# EasyEDA Pro project Usb_Hub-EasyEdaPro_Project.epro

# Schematic Schematic1
Board Name: Board1; Create Date: 2026-04-02; Page Name: P1; Project Name: Usb_Hub; Schematic Name: Schematic1; Update Date: 2026-04-02; Company: EasyEDA.com; Page Size: A4; Version: V1.0
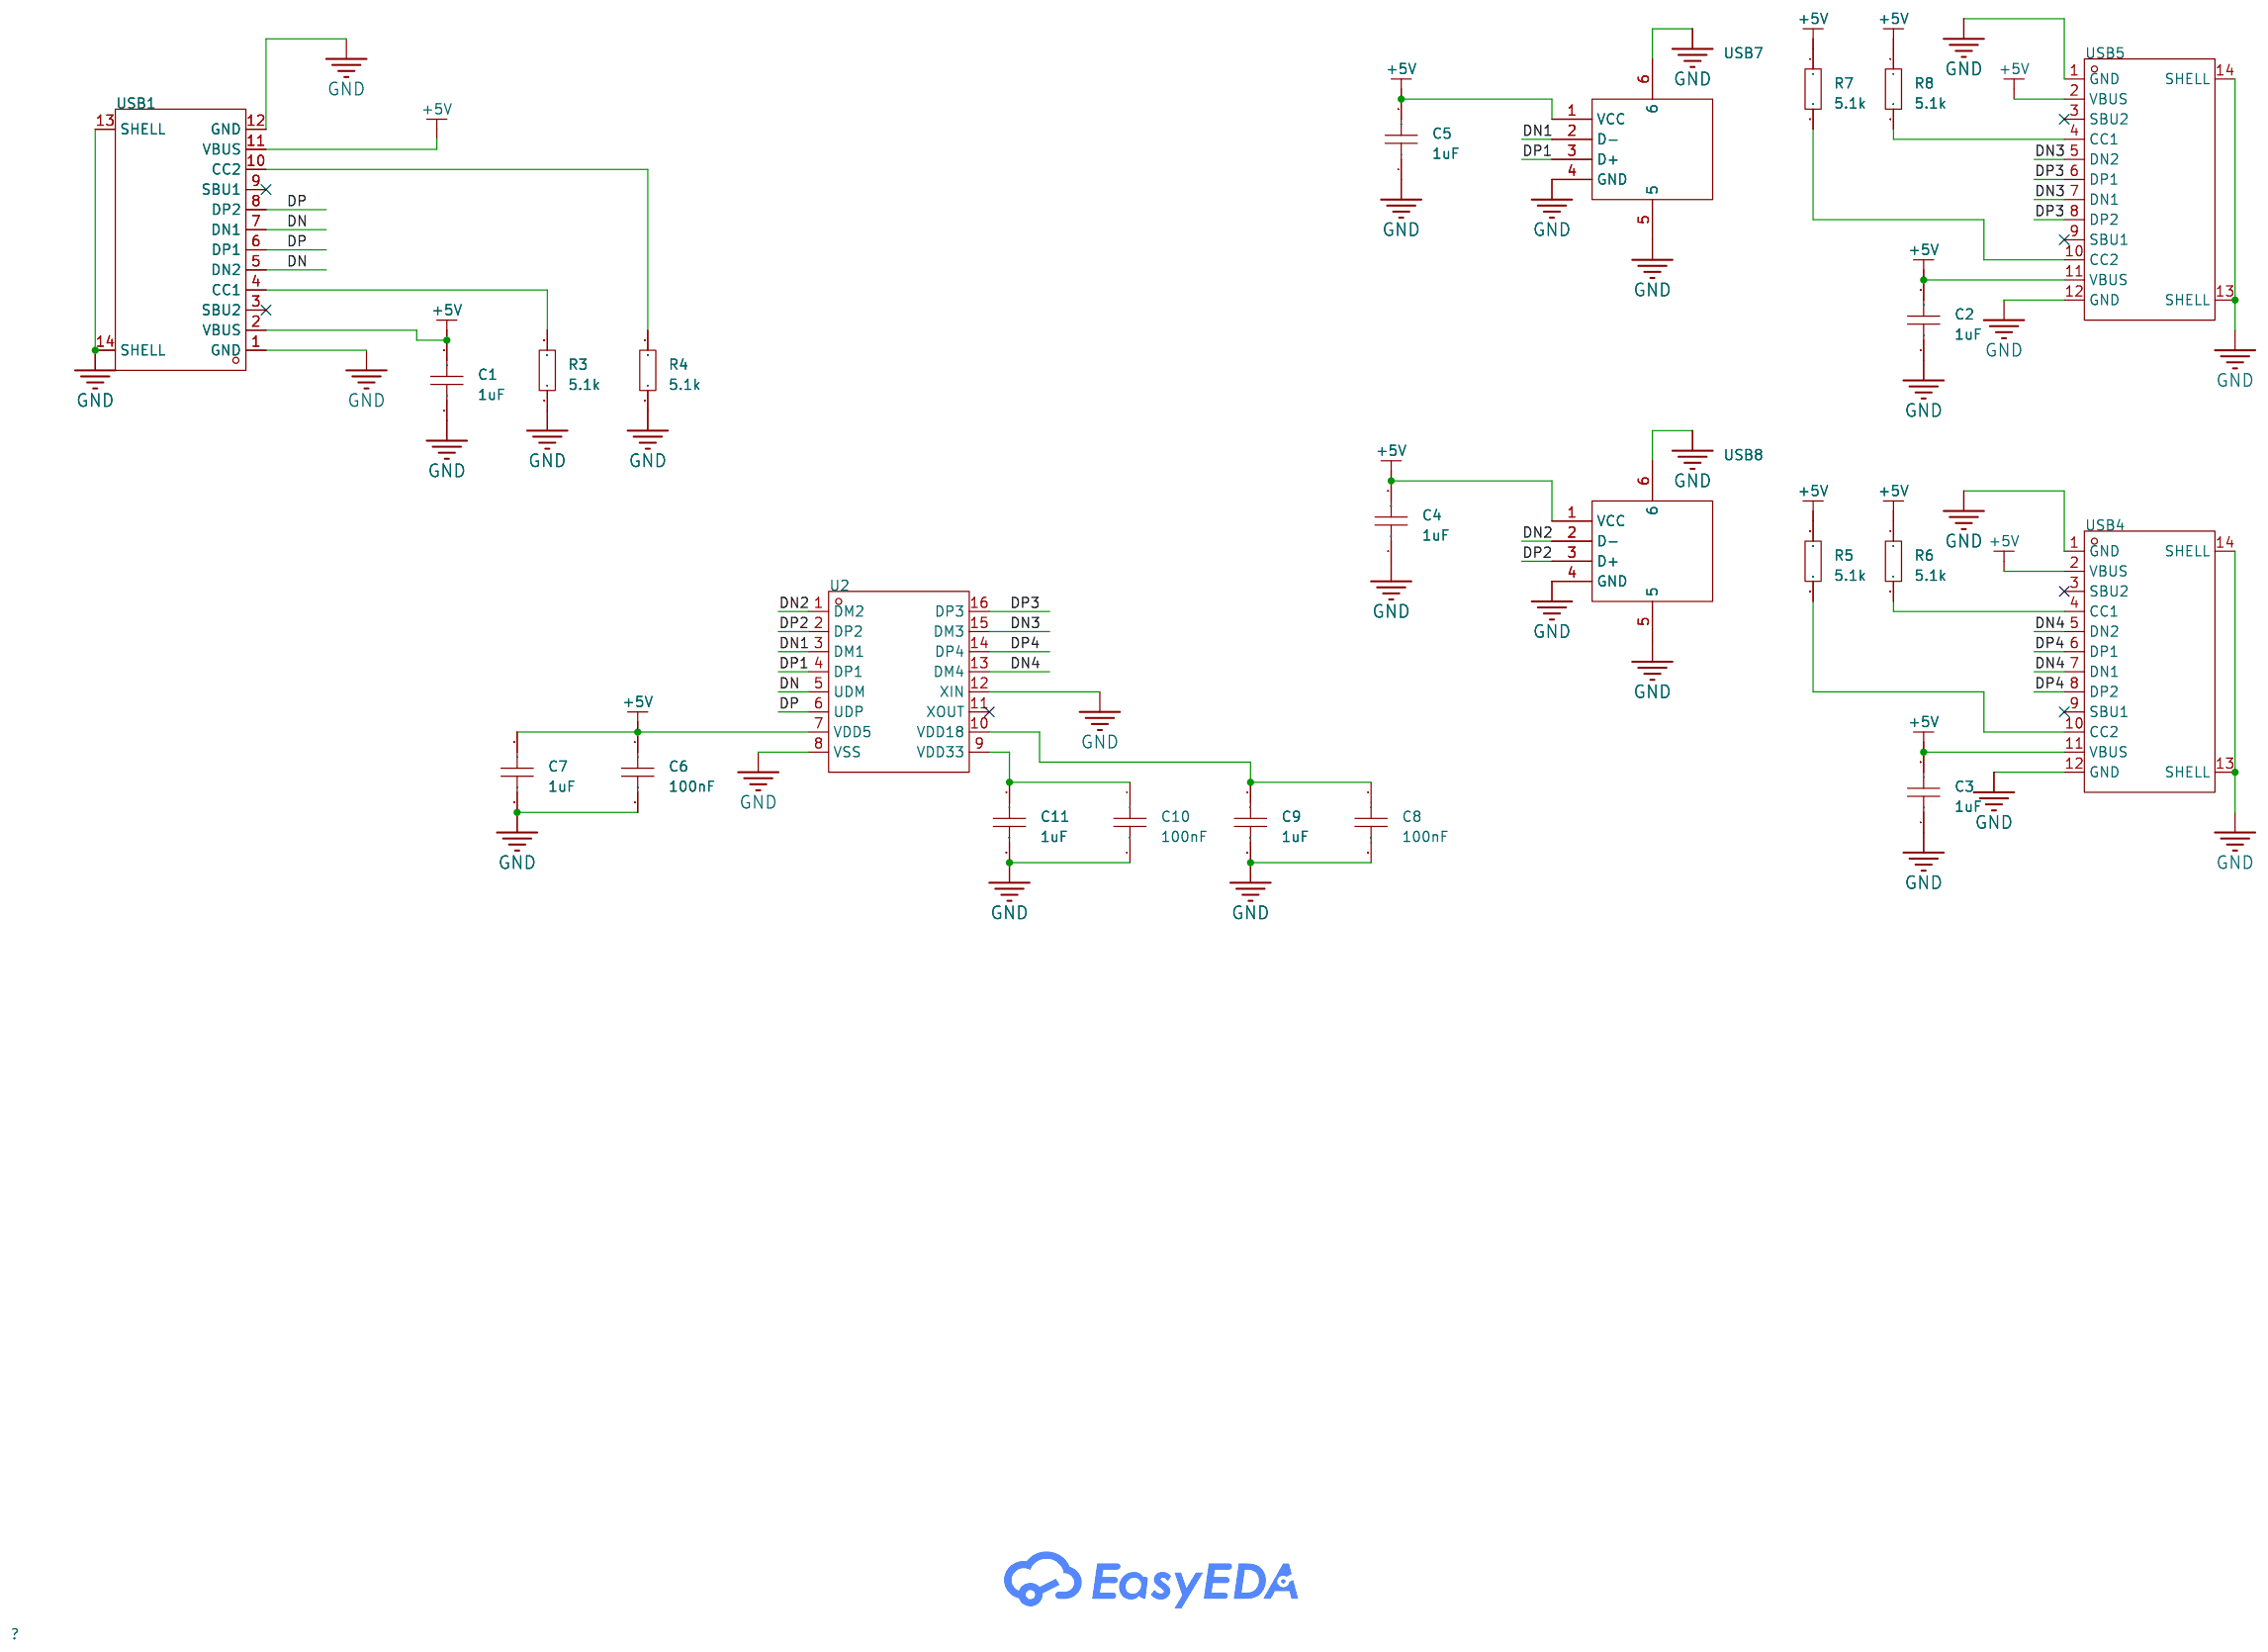
[diagram p0: schematic sheet]

## Parts
C1  1uF  [C0603]
C2  1uF  [C0603]
C3  1uF  [C0603]
C4  1uF  [C0603]
C5  1uF  [C0603]
C6  100nF  [C0603]
C7  1uF  [C0603]
C8  100nF  [C0603]
C9  1uF  [C0603]
C10  100nF  [C0603]
C11  1uF  [C0603]
R3  5.1k  [R0603]
R4  5.1k  [R0603]
R5  5.1k  [R0603]
R6  5.1k  [R0603]
R7  5.1k  [R0603]
R8  5.1k  [R0603]
U2  SL2.1s  [SSOP-16_L4.6-W2.6-P0.53-LS4.0-BL]
USB1  TYPE-C 16PIN 2MD(073)  [USB-C-SMD_TYPE-C-6PIN-2MD-073]
USB4  TYPE-C 16PIN 2MD(073)  [USB-C-SMD_TYPE-C-6PIN-2MD-073]
USB5  TYPE-C 16PIN 2MD(073)  [USB-C-SMD_TYPE-C-6PIN-2MD-073]
USB7  10.0 QHHTZB6.3  [USB-A-TH_10.0QHHTZB6.3]
USB8  10.0 QHHTZB6.3  [USB-A-TH_10.0QHHTZB6.3]

## Library data of the parts
C1-C11 = CAP_0603: Supplier Footprint: 0603
R3-R8 = Res_0603: Supplier Footprint: 0603
U2 = SL2.1s: type:Hub USB Protocol:USB 2.0 Voltage - Supply:4V~5.25V Voltage - Supply:4V~5.25V Operating Temperature:0℃~+70℃ Operating Temperature:0℃~+70℃ Current - Supply:120mA Quiescent Supply Current:2.5mA Number of Channels:4; LCSC Part Name: USB2.0 HUB控制器集成电路; Supplier Part: C2684433; Manufacturer: CoreChips(和芯润德); Supplier Footprint: SSOP-16; JLCPCB Part Class: Extended Part; Datasheet: https://item.szlcsc.com/datasheet/SL2.1s/2782346.html; Supplier: LCSC; type: Hub; USB Protocol: USB 2.0; Voltage - Supply: 4V~5.25V; Operating Temperature: 0℃~+70℃; Current - Supply: 120mA; Quiescent Supply Current: 2.5mA; Number of Channels: 4
USB1 USB4 USB5 = TYPE-C 16PIN 2MD(073): Connector Type:Type-C Protocol Standard:- Gender:Female Mounting Type:Surface Mount, Right Angle Number of Contacts:16P Number of Ports:1 Current Rating-Power:3A Voltage Rating:5V Connect-Disconnect Life:10,000 Cycles Supplementary Features:- Center Heigh; LCSC Part Name: Type-C 母 卧贴; Supplier Part: C2765186; Manufacturer: SHOU HAN(首韩); Supplier Footprint: SMD; JLCPCB Part Class: Extended Part; Datasheet: https://item.szlcsc.com/datasheet/TYPE-C%252016PIN%25202MD(073)/2901843.html; Supplier: LCSC; Connector Type: Type-C; Gender: Female; Mounting Type: Surface Mount, Right Angle; Number of Contacts: 16P; Number of Ports: 1; Current Rating-Power: 3A; Voltage Rating: 5V; Connect-Disconnect Life: 10,000 Cycles; Detection color: Black; Operating Temperature: -25℃~+85℃
USB7 USB8 = 10.0 QHHTZB6.3: Connector Type:Type-A Protocol Standard:USB 2.0 Gender:Female Mounting Type:Surface Mount, Right Angle Number of Contacts:4P Number of Ports:1 Current Rating-Power:1.5A Voltage Rating:30V Connect-Disconnect Life:5,000 times Supplementary Features:- Center; LCSC Part Name: 壳长10.0mm; Supplier Part: C668591; Manufacturer: SHOU HAN(首韩); Supplier Footprint: SMD; JLCPCB Part Class: Extended Part; Datasheet: https://item.szlcsc.com/datasheet/10.0%2520QHHTZB6.3/698534.html; Supplier: LCSC; Connector Type: Type-A; Protocol Standard: USB 2.0; Gender: Female; Mounting Type: Surface Mount, Right Angle; Number of Contacts: 4P; Number of Ports: 1; Current Rating-Power: 1.5A; Voltage Rating: 30V; Connect-Disconnect Life: 5,000 times; Length: 10mm; Detection color: Black; Operating Temperature: -25℃~+85℃

## Nets
+5V: C1.2 C2.2 C3.2 C4.2 C5.2 C6.1 C7.1 R5.1 R6.1 R7.1 R8.1 U2.7(VDD5) USB1.2(VBUS) USB1.11(VBUS) USB4.2(VBUS) USB4.11(VBUS) USB5.2(VBUS) USB5.11(VBUS) USB7.1(VCC) USB8.1(VCC)
GND: C1.1 C2.1 C3.1 C4.1 C5.1 C6.2 C7.2 C8.2 C9.2 C10.2 C11.2 R3.1 R4.1 U2.8(VSS) U2.12(XIN) USB1.1(GND) USB1.12(GND) USB1.13(SHELL) USB1.14(SHELL) USB4.1(GND) USB4.12(GND) USB4.13(SHELL) USB4.14(SHELL) USB5.1(GND) USB5.12(GND) USB5.13(SHELL) USB5.14(SHELL) USB7.4(GND) USB7.5 USB7.6 USB8.4(GND) USB8.5 USB8.6
DN: U2.5(UDM) USB1.5(DN2) USB1.7(DN1)
DN1: U2.3(DM1) USB7.2(D-)
DN2: U2.1(DM2) USB8.2(D-)
DN3: U2.15(DM3) USB5.5(DN2) USB5.7(DN1)
DN4: U2.13(DM4) USB4.5(DN2) USB4.7(DN1)
DP: U2.6(UDP) USB1.6(DP1) USB1.8(DP2)
DP1: U2.4(DP1) USB7.3(D+)
DP2: U2.2(DP2) USB8.3(D+)
DP3: U2.16(DP3) USB5.6(DP1) USB5.8(DP2)
DP4: U2.14(DP4) USB4.6(DP1) USB4.8(DP2)
$1N2151: R3.2 USB1.4(CC1)
$1N2154: R4.2 USB1.10(CC2)
$1N2984: R5.2 USB4.10(CC2)
$1N3131: R6.2 USB4.4(CC1)
$1N3260: R7.2 USB5.10(CC2)
$1N3267: R8.2 USB5.4(CC1)
$1N3816: C10.1 C11.1 U2.9(VDD33)
$1N3846: C8.1 C9.1 U2.10(VDD18)

Not connected (* = marked no-connect by the designer): U2 11(XOUT)*; USB1 3(SBU2)* 9(SBU1)*; USB4 3(SBU2)* 9(SBU1)*; USB5 3(SBU2)* 9(SBU1)*

# Board PCB1
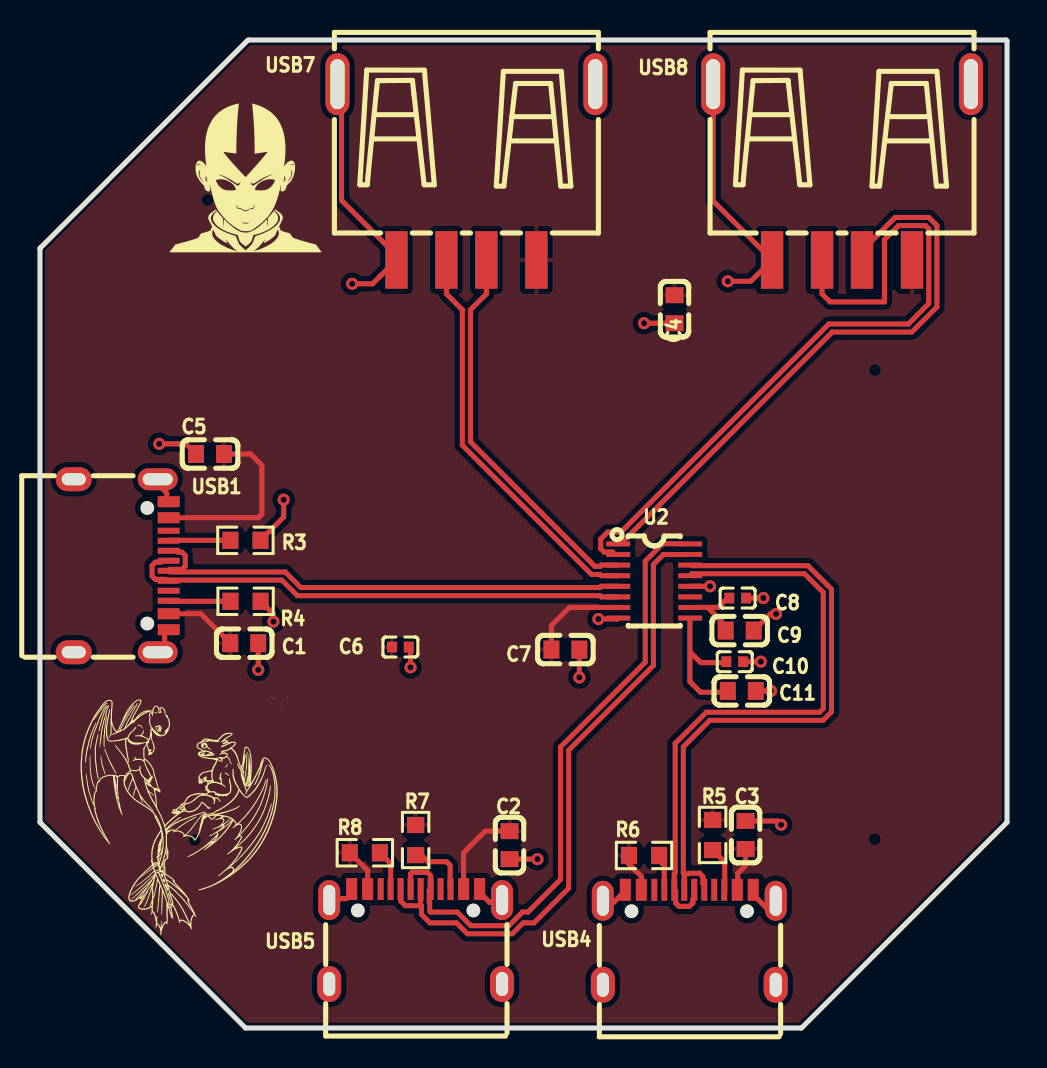
[diagram p1: board, top side]
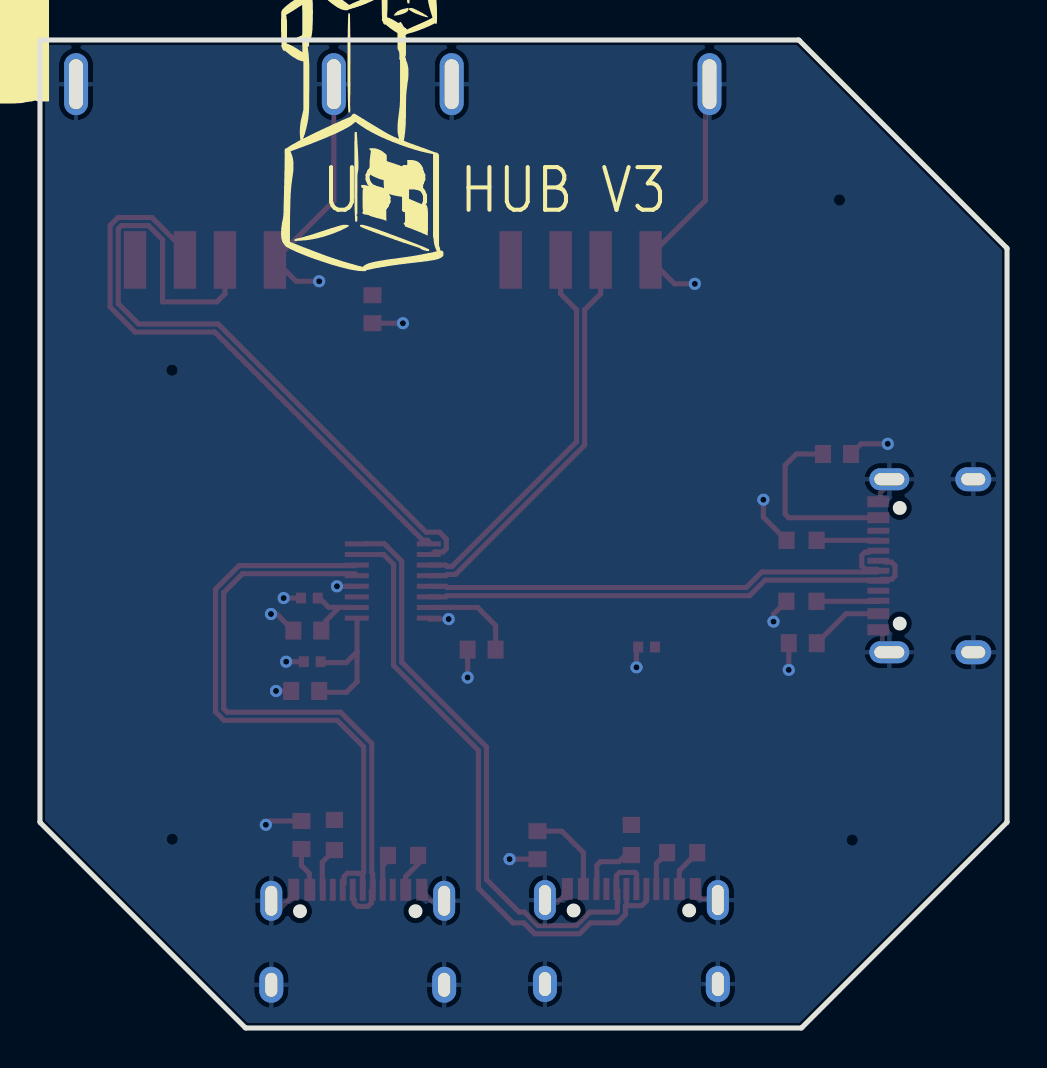
[diagram p2: board, bottom side, seen from below]

Outline 48.39 x 49.4 mm; copper layers: Top Layer, Bottom Layer. Coordinates in mm from the lower left corner of the outline.
Outline path: 0,38.97 0,10.31 arc(0,10.29) 0.02,10.27 10.27,0.01 arc(10.29,0) 10.31,0 38.08,0 arc(38.1,0) 38.11,0.01 48.37,10.27 arc(48.38,10.29) 48.39,10.31 48.39,49.35 arc(48.37,49.39) 48.34,49.4 10.44,49.4 arc(10.42,49.4) 10.4,49.39 0.02,39 arc(0,38.99) 0,38.97
Stack: Top Layer 0.035mm / Dielectric1 1.51mm FR4 er 4.5 / Bottom Layer 0.035mm

## Design rules (mm)
net DN2: DP5
net DP2: DP5
net DN1: DP4
net DP1: DP4
net DN: DP1
net DP: DP1
net DN4: DP3
net DP4: DP3
net DN3: DP2
net DP3: DP2
template: Custom Config
spacing copperThickness1oz (default): track to track 0.102, other pairs 0.152 to 0.3
spacing copperThickness2oz: track to track 0.203, other pairs 0.152 to 0.3
track width copperThickness1oz (default): min 0.127, default 0.254, max 2.54
track width copperThickness2oz: min 0.203, default 0.254, max 2.54
differential pair differentialPair (default): width min 0.127, default 0.254, max 2.54; gap min 0.152, default 0.152
via viaSize (default): diameter min 0.5, default 0.61, max 10; hole min 0.3, default 0.305, max 6.3

## Placement (name value [footprint] x y rotation side)
C1  1uF  [C0603]  10.22 19.24 180 top
C2  1uF  [C0603]  23.5 9.14 90 top
C3  1uF  [C0603]  35.31 9.65 270 top
C4  1uF  [C0603]  31.75 35.94 90 top
C5  1uF  [C0603]  8.51 28.7 0 top
C6  100nF  [C0402]  18.03 19.05 0 top
C7  1uF  [C0603]  26.29 18.92 0 top
C8  100nF  [C0402]  34.91 21.5 0 top
C9  1uF  [C0603]  35.01 19.87 0 top
C10  100nF  [C0402]  34.76 18.32 0 top
C11  1uF  [C0603]  35.12 16.85 0 top
R3  5.1k  [R0603]  10.28 24.38 180 top
R4  5.1k  [R0603]  10.29 21.34 180 top
R5  5.1k  [R0603]  33.66 9.65 270 top
R6  5.1k  [R0603]  30.22 8.63 0 top
R7  5.1k  [R0603]  18.8 9.4 270 top
R8  5.1k  [R0603]  16.26 8.76 0 top
U2  SL2.1s  [SSOP-16_L4.6-W2.6-P0.53-LS4.0-BL]  30.73 22.35 270 top
USB1  TYPE-C 16PIN 2MD(073)  [USB-C-SMD_TYPE-C-6PIN-2MD-073]  4.06 23.11 270 top
USB4  TYPE-C 16PIN 2MD(073)  [USB-C-SMD_TYPE-C-6PIN-2MD-073]  32.49 4.54 0 top
USB5  TYPE-C 16PIN 2MD(073)  [USB-C-SMD_TYPE-C-6PIN-2MD-073]  18.8 4.57 0 top
USB7  10.0 QHHTZB6.3  [USB-A-TH_10.0QHHTZB6.3]  21.34 42.8 180 top
USB8  10.0 QHHTZB6.3  [USB-A-TH_10.0QHHTZB6.3]  40.13 42.8 180 top

## Footprints (pads in the part's own frame, mm; a bottom-side part is the same pattern mirrored in y, then rotated)
C0402
  rect 0.5x0.54 smd: 1(-0.42,0) 2(0.42,0)
C0603
  rect 0.8x0.9 smd: 1(-0.7,0) 2(0.7,0)
R0603
  rect 0.806x0.864 smd: 1(-0.753,0) 2(0.753,0)
SSOP-16_L4.6-W2.6-P0.53-LS4.0-BL
  rect 0.25x1.2 smd: 1(-1.855,-1.8) 2(-1.325,-1.8) 3(-0.795,-1.8) 4(-0.265,-1.8) 5(0.265,-1.8) 6(0.795,-1.8) 7(1.325,-1.8) 8(1.855,-1.8) 9(1.855,1.8) 10(1.325,1.8) 11(0.795,1.8) 12(0.265,1.8) 13(-0.265,1.8) 14(-0.795,1.8) 15(-1.325,1.8) 16(-1.855,1.8)
USB-A-TH_10.0QHHTZB6.3
  rect 1.12x2.88 smd: 1(-3.5,4.395) 2(-1,4.395) 3(1,4.395) 4(3.5,4.395)
  oval 1.2x3.1 hole 0.7x2.5: 5(-6.45,-4.395) 6(6.45,-4.395)
USB-C-SMD_TYPE-C-6PIN-2MD-073
  rect 0.55x1.1 smd: 1(-3.2,2.375) 2(-2.4,2.375) 11(2.4,2.375) 12(3.2,2.375)
  rect 0.3x1.1 smd: 3(-1.75,2.375) 4(-1.25,2.375) 5(-0.75,2.375) 6(-0.25,2.375) 7(0.25,2.375) 8(0.75,2.375) 9(1.25,2.375) 10(1.75,2.375)
  oval 1.1x2 hole 0.6x1.5: 13(-4.325,1.825) 14(4.325,1.825)
  oval 1.2x1.8 hole 0.6x1.2: 13(-4.325,-2.375) 14(4.325,-2.375)

## Nets
As in the schematic.

Pads without a net: U2 11; USB1 3 9; USB4 3 9; USB5 3 9

## Via types
v1: diameter 0.61, hole 0.305, Top Layer to Bottom Layer, 17 vias

## Routing (per net, layer and track width the routed paths; a pad name or vN(x,y) marks a point on that pad's centre or on a via; arc(x,y) is an arc through that point)
+5V: length 28.6
  Top Layer w0.254: 29.35,8.51 29.35,8.32 30.1,7.57 30.1,7.17 ; USB5.2 16.4,7.87 R8.1 ; C7.1 25.59,20.13 26.49,21.03 27.69,21.03 27.7,21.03 28.18,21.03 28.19,21.03 28.93,21.03 ; USB1.11 8.05,20.71 C1.2 ; USB1.2 10.92,25.51 11.1,25.69 11.1,28.14 10.54,28.7 C5.2 ; C3.2 35.31,8.13 34.91,7.73 34.91,6.82 ; C2.2 22.28,9.84 21.2,8.76 USB5.11
GND: length 52.7
  Top Layer w0.254: C3.1 36.89,10.35 v1(37.08,10.16) ; v1(12.19,26.42) 12.19,25.54 R3.1 ; v1(15.62,37.21) 16.64,37.21 USB7.4 ; C11.2 v1(36.58,16.85) ; C1.1 v1(10.92,17.91) ; C2.1 v1(24.89,8.44) ; 35.66,6.69 36.32,6.03 36.63,6.03 ; 22.98,6.28 22.5,6.28 21.88,6.9 ; 14.44,6.47 15.33,6.47 15.69,6.82 ; 15.09,46.96 15.09,41.38 17.73,38.74 ; v1(27.94,20.45) 28.88,20.45 28.93,20.5 ; C8.2 v1(36.2,21.5) ; 6.24,19.72 6.24,19.11 5.9,18.77 ; C5.1 7.3,29.21 v1(5.97,29.21) ; v1(18.54,18.03) 18.54,18.96 C6.2 ; C4.1 v1(30.23,35.24) ; U2.12 v1(33.53,22.09) ; R4.1 11.68,20.69 v1(11.68,20.32) ; C7.2 v1(26.99,17.53) ; v1(36.83,20.7) 36.54,20.7 C9.2 ; C10.2 v1(36.07,18.32) ; 29.28,6.86 28.7,6.28 28.29,6.28 ; v1(34.42,37.34) 35.57,37.34 USB8.4 33.68,41.35 USB8.6 ; 5.76,27.33 6.34,26.76 6.34,26.23
DN: length 24.8
  Top Layer w0.254: 6.83,23.87 6.91,23.79 7.1,23.79 7.27,23.63 7.27,23.1 7.1,22.93 6.51,22.93 USB1.7 ; 6.5,22.8 12.27,22.8 13.05,22.02 28.02,22.02 28.08,22.09 28.93,22.09
DN1: length 19.4
  Top Layer w0.254: 28.93,23.15 28.08,23.15 28.02,23.08 27.76,23.08 21.54,29.31 21.54,35.91 22.34,36.71 USB7.2
DN2: length 30.1
  Top Layer w0.254: 28.93,24.21 28.93,24.33 28.99,24.39 29.23,24.39 39.64,34.8 43.62,34.8 44.88,36.05 44.88,40.13 44.48,40.53 42.79,40.53 41.13,38.87 USB8.2
DN3: length 31.4
  Top Layer w0.254: 32.34,23.68 31.19,23.68 30.69,23.18 30.69,18.12 26.45,13.88 26.45,6.99 24.72,5.26 24.18,5.26 23.63,4.71 21.39,4.71 20.84,5.26 19.51,5.26 19.09,5.67 19.09,6.1 19.05,6.14 ; 19.05,6.14 19.05,6.05 18.98,6.12 18.28,6.12 18.04,6.36 18.04,6.74 ; 19.05,6.14 19.05,6.14 USB5.7
DN4: length 30.3
  Top Layer w0.254: 32.59,22.71 38.26,22.71 39.2,21.77 39.2,15.97 39.02,15.79 33.35,15.79 31.78,14.23 31.78,7.76 31.74,7.71 USB4.5 31.81,6.84 31.81,6.25 31.97,6.08 32.5,6.08 32.67,6.25 32.67,6.43 32.76,6.53
DP: length 24.9
  Top Layer w0.254: 28.93,21.56 28.08,21.56 28.02,21.62 12.88,21.62 12.1,22.4 6.5,22.4 ; USB1.8 6.41,22.4 6.33,22.4 6.29,22.43 5.77,22.43 5.61,22.6 5.61,23.13 5.77,23.29 6.05,23.29 6.13,23.37
DP1: length 20.1
  Top Layer w0.254: USB7.3 20.34,36.71 21.13,35.91 21.13,29.14 27.6,22.68 28.02,22.68 28.08,22.62 28.93,22.62
DP2: length 37.2
  Top Layer w0.254: 28.93,23.68 28.77,23.68 28.64,23.8 28.22,23.8 28.05,23.97 28.05,24.45 28.4,24.79 29.06,24.79 39.47,35.2 43.45,35.2 44.47,36.22 44.47,39.96 44.31,40.12 42.96,40.12 42.25,39.42 42.25,36.31 39.53,36.31 39.13,36.71 USB8.3
DP3: length 31.4
  Top Layer w0.254: 32.13,24.21 32.13,24.21 31.16,24.21 30.29,23.34 30.29,18.29 26.05,14.05 26.05,7.42 24.42,5.8 24.14,5.8 23.46,5.12 21.56,5.12 20.88,5.8 19.55,5.8 19.5,5.84 19.5,6.26 19.48,6.29 19.48,6.88 USB5.8 19.55,7.63 19.39,7.78 18.61,7.78 18.54,7.71 18.54,6.88
DP4: length 30.4
  Top Layer w0.254: 32.24,7.71 32.19,7.76 32.19,14.06 33.52,15.39 39.18,15.39 39.6,15.8 39.6,21.94 38.42,23.12 32.59,23.12 ; 32.24,7.71 USB4.6 ; 32.24,7.71 32.45,7.71 32.47,7.74 33,7.74 33.17,7.58 33.17,7.25 33.25,7.16
$1N2151: length 3.1
  Top Layer w0.254: USB1.4 6.46,24.38 R3.2
$1N2154: length 3.1
  Top Layer w0.254: USB1.10 6.47,21.34 R4.2
$1N2984: length 2.3
  Top Layer w0.254: 34.26,6.82 34.26,8.29 R5.2
$1N3131: length 1.6
  Top Layer w0.254: 31.24,7.05 31.24,8.12 30.85,8.51
$1N3260: length 3.1
  Top Layer w0.254: USB5.10 20.52,6.97 20.52,8.14 20.35,8.32 19.42,8.32 19.09,8.64 R7.2
$1N3267: length 2
  Top Layer w0.254: R8.2 17.55,8.23 USB5.4
$1N3816: length 7.2
  Top Layer w0.254: 32.52,18.81 32.52,17.32 33.05,16.79 34.32,16.79 34.33,16.78 ; 32.52,18.81 33.06,18.27 34.31,18.27 ; 32.52,18.81 32.52,20.43 32.55,20.46
$1N3846: length 3.1
  Top Layer w0.254: 33.42,21.02 34.09,20.35 34.09,19.81 ; 34.33,21.43 33.94,21.03 32.87,21.03

## Copper pours and planes (outline as drawn; the poured copper is in the pictures)
+5V on Top Layer: -4.83,51.82 55.88,51.82 55.88,-2.41 -4.83,-2.41
GND on Bottom Layer: -4.58,50.65 52.79,50.65 52.79,-2.18 -4.58,-2.18
GND on Bottom Layer: -9.27,54.39 59.78,54.39 59.78,-10.99 -9.27,-10.99

## Text on the board
Bottom Silkscreen Layer: USB HUB V3
